# Altium schematic sheet Sheet2.SchDoc
size A; SheetNumber: 2; SheetTotal: 2
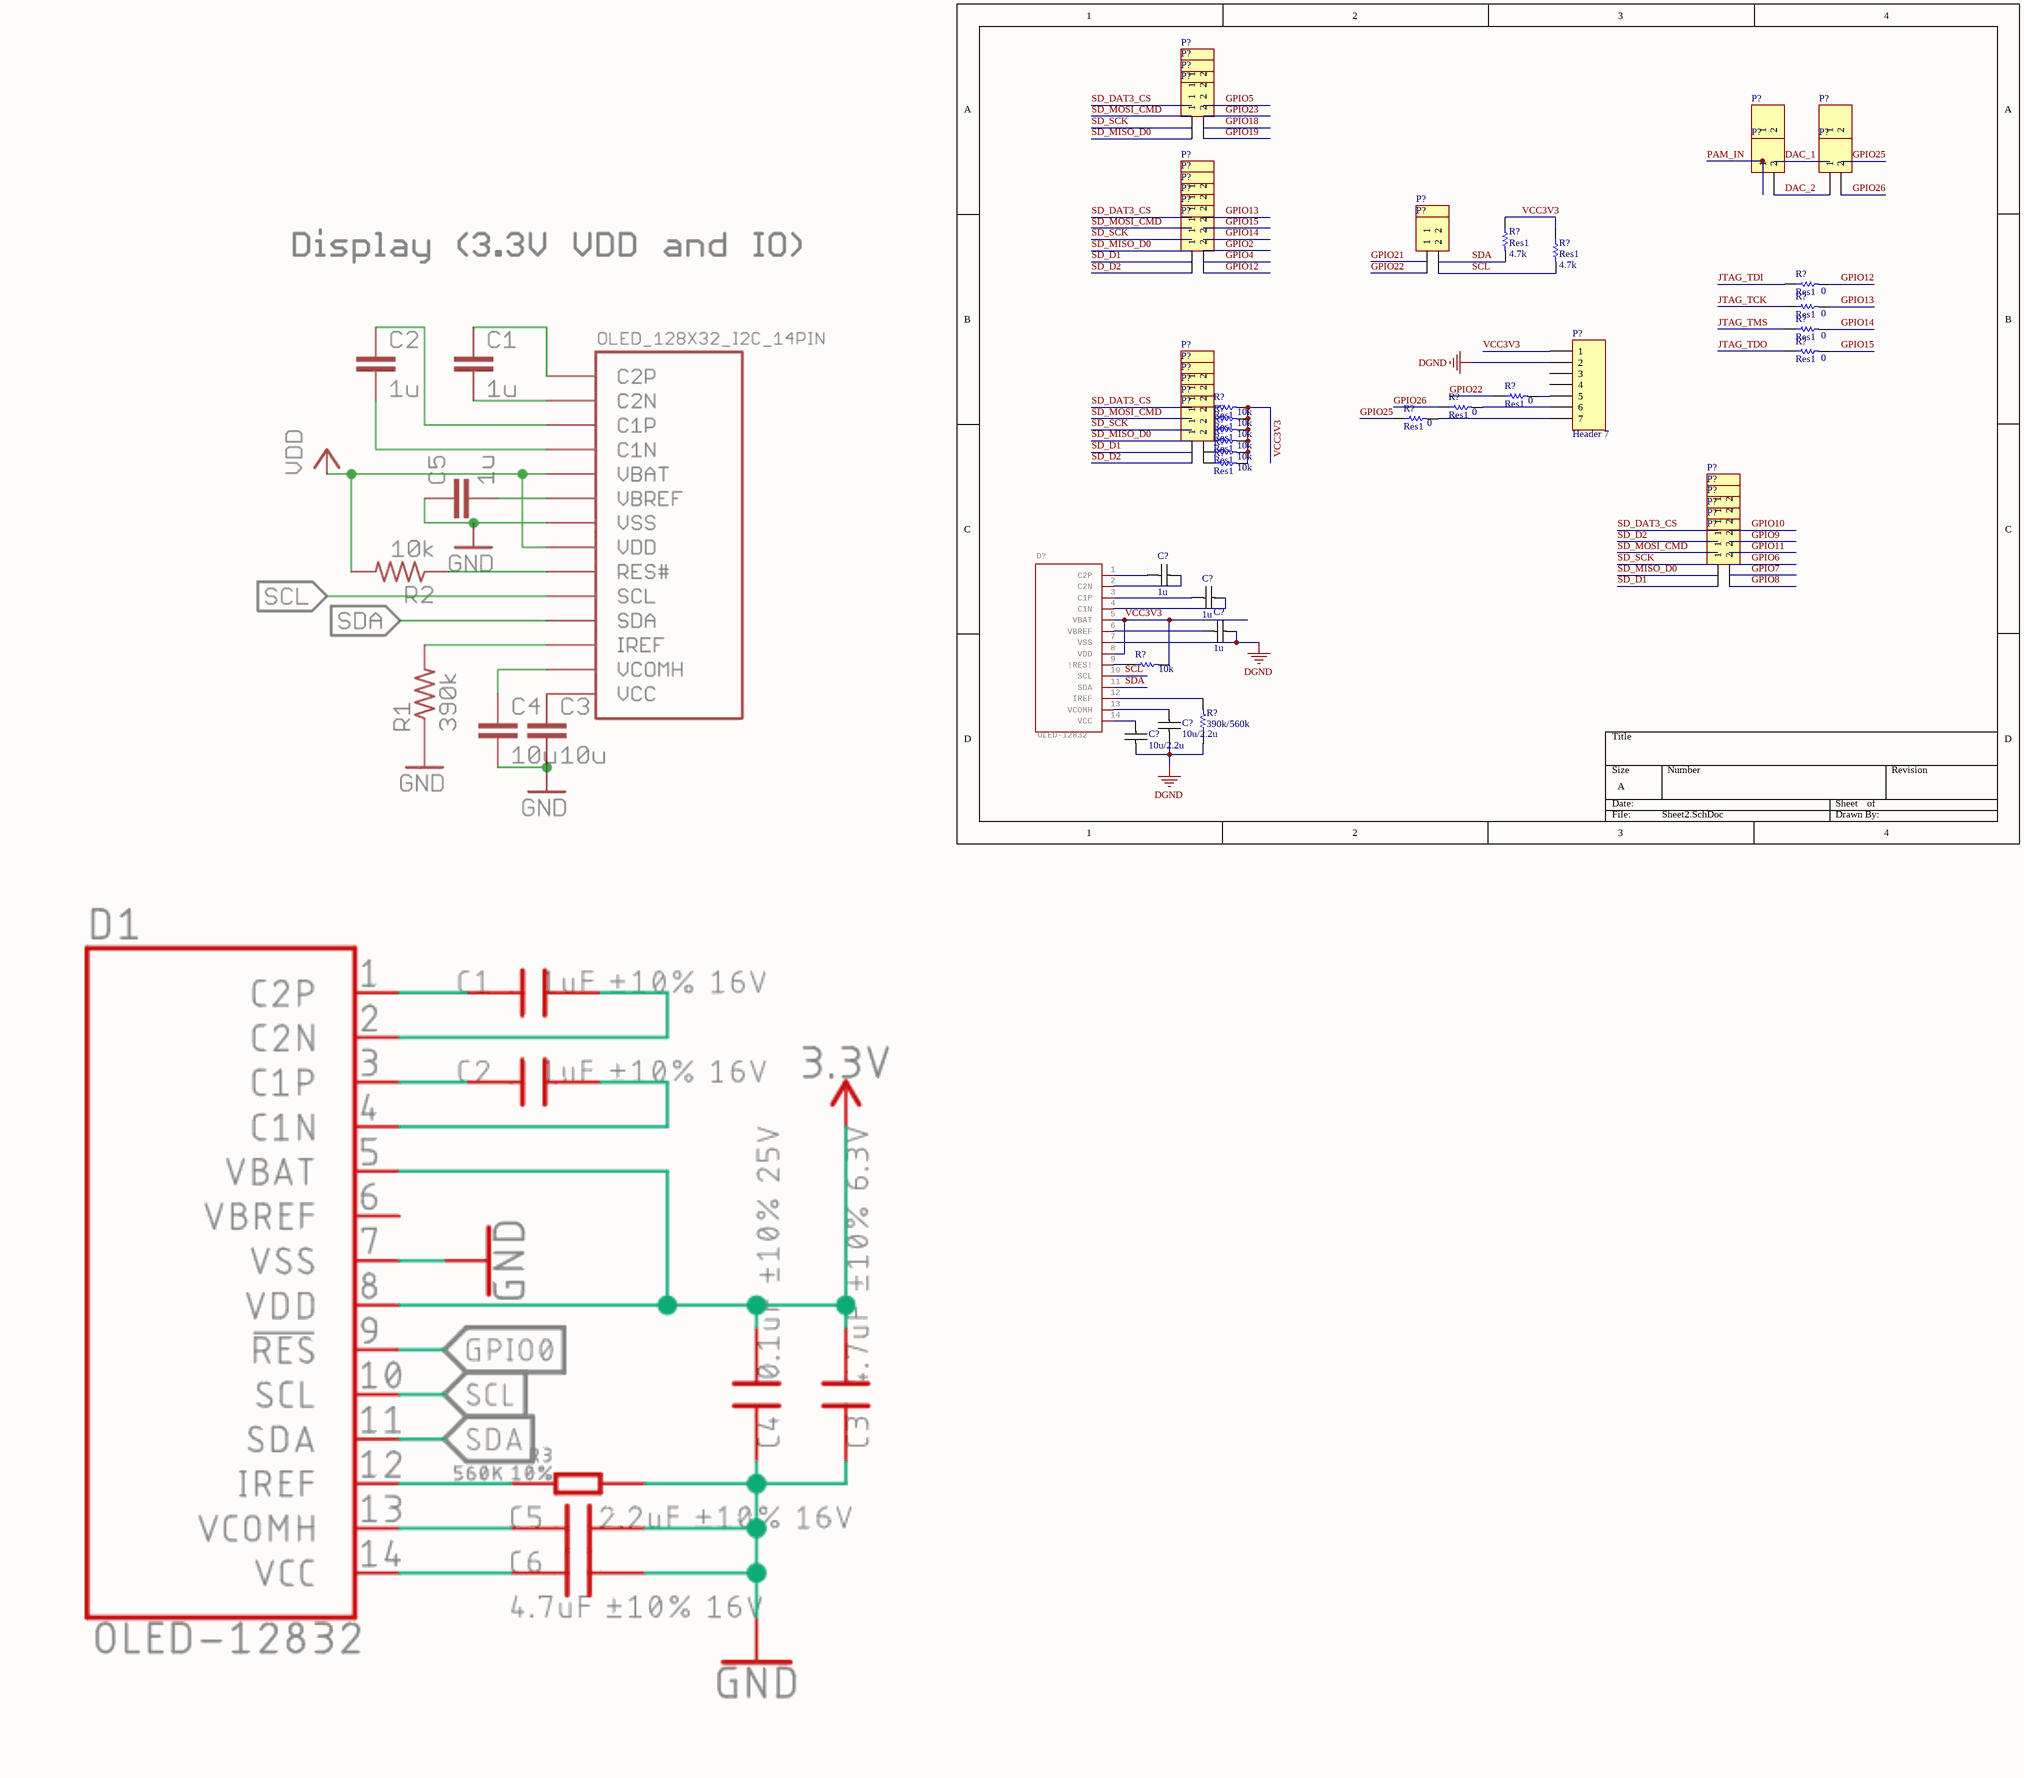
[diagram p0: Sheet2.SchDoc]

## Parts
(Parts that share a designator on the sheet are numbered #1, #2 ... from top to bottom, then left to right.)
C?#1  1u  [C 0603 / 1608]
C?#2  1u  [C 0603 / 1608]
C?#3  1u  [C 0603 / 1608]
C?#4  10u/2.2u  [C 0603 / 1608]
C?#5  10u/2.2u  [C 0603 / 1608]
D?  OLED-12832  [OLED-12832]
P?#1  Header 2  [HDR1X2]  (value not drawn)
P?#2  Header 2  [HDR1X2]  (value not drawn)
P?#3  Header 2  [HDR1X2]  (value not drawn)
P?#4  Header 2  [HDR1X2]  (value not drawn)
P?#5  Header 2  [HDR1X2]  (value not drawn)
P?#6  Header 2  [HDR1X2]  (value not drawn)
P?#7  Header 2  [HDR1X2]  (value not drawn)
P?#8  Header 2  [HDR1X2]  (value not drawn)
P?#9  Header 2  [HDR1X2]  (value not drawn)
P?#10  Header 2  [HDR1X2]  (value not drawn)
P?#11  Header 2  [HDR1X2]  (value not drawn)
P?#12  Header 2  [HDR1X2]  (value not drawn)
P?#13  Header 2  [HDR1X2]  (value not drawn)
P?#14  Header 2  [HDR1X2]  (value not drawn)
P?#15  Header 2  [HDR1X2]  (value not drawn)
P?#16  Header 2  [HDR1X2]  (value not drawn)
P?#17  Header 7  [HDR1X7]
P?#18  Header 2  [HDR1X2]  (value not drawn)
P?#19  Header 2  [HDR1X2]  (value not drawn)
P?#20  Header 2  [HDR1X2]  (value not drawn)
P?#21  Header 2  [HDR1X2]  (value not drawn)
P?#22  Header 2  [HDR1X2]  (value not drawn)
P?#23  Header 2  [HDR1X2]  (value not drawn)
P?#24  Header 2  [HDR1X2]  (value not drawn)
P?#25  Header 2  [HDR1X2]  (value not drawn)
P?#26  Header 2  [HDR1X2]  (value not drawn)
P?#27  Header 2  [HDR1X2]  (value not drawn)
P?#28  Header 2  [HDR1X2]  (value not drawn)
P?#29  Header 2  [HDR1X2]  (value not drawn)
R?#1  Res1  value 4.7k  [C 0603 / 1608]
R?#2  Res1  value 4.7k  [C 0603 / 1608]
R?#3  Res1  value 0  [C 0603 / 1608]
R?#4  Res1  value 0  [C 0603 / 1608]
R?#5  Res1  value 0  [C 0603 / 1608]
R?#6  Res1  value 0  [C 0603 / 1608]
R?#7  Res1  value 0  [C 0603 / 1608]
R?#8  Res1  value 10k  [C 0603 / 1608]
R?#9  Res1  value 0  [C 0603 / 1608]
R?#10  Res1  value 10k  [C 0603 / 1608]
R?#11  Res1  value 0  [C 0603 / 1608]
R?#12  Res1  value 10k  [C 0603 / 1608]
R?#13  Res1  value 10k  [C 0603 / 1608]
R?#14  Res1  value 10k  [C 0603 / 1608]
R?#15  Res1  value 10k  [C 0603 / 1608]
R?#16  value 10k  [C 0603 / 1608]  (hidden comment: Res1)
R?#17  value 390k/560k  [C 0603 / 1608]  (hidden comment: Res1)

## Nets
DGND: C?#3.2 C?#4.1 C?#5.1 D?.7(VSS) P?#17.2 R?#17.1
DAC_1: P?#5.2 P?#6.1
DAC_2: P?#7.2 P?#8.1
GPIO2: P?#12.2
GPIO4: P?#13.2
GPIO5: P?#1.2
GPIO6: P?#27.2
GPIO7: P?#28.2
GPIO8: P?#29.2
GPIO9: P?#25.2
GPIO10: P?#24.2
GPIO11: P?#26.2
GPIO12: P?#15.2 R?#3.2
GPIO13: P?#9.2 R?#4.2
GPIO14: P?#11.2 R?#5.2
GPIO15: P?#10.2 R?#6.2
GPIO18: P?#3.2
GPIO19: P?#4.2
GPIO21: P?#14.1
GPIO22: P?#16.1 R?#7.1
GPIO23: P?#2.2
GPIO25: P?#6.2 R?#11.1
GPIO26: P?#8.2 R?#9.1
JTAG_TCK: R?#4.1
JTAG_TDI: R?#3.1
JTAG_TDO: R?#6.1
JTAG_TMS: R?#5.1
PAM_IN: P?#5.1 P?#7.1
SCL: D?.10(SCL) P?#16.2 R?#2.2
SD_D1: P?#13.1 P?#22.1 P?#29.1
SD_D2: P?#15.1 P?#23.1 P?#25.1
SD_DAT3_CS: P?#1.1 P?#9.1 P?#18.1 P?#24.1
SD_MISO_D0: P?#4.1 P?#12.1 P?#21.1 P?#28.1
SD_MOSI_CMD: P?#2.1 P?#10.1 P?#19.1 P?#26.1
SD_SCK: P?#3.1 P?#11.1 P?#20.1 P?#27.1
SDA: D?.11(SDA) P?#14.2 R?#1.2
VCC3V3: D?.5(VBAT) D?.8(VDD) P?#17.1 R?#1.1 R?#2.1 R?#8.2 R?#10.2 R?#12.2 R?#13.2 R?#14.2 R?#15.2 R?#16.2
NetC?#1_1: C?#1.1 D?.1(C2P)
NetC?#1_2: C?#1.2 D?.2(C2N)
NetC?#2_1: C?#2.1 D?.3(C1P)
NetC?#2_2: C?#2.2 D?.4(C1N)
NetC?#3_1: C?#3.1 D?.6(VBREF)
NetC?#4_2: C?#4.2 D?.13(VCOMH)
NetC?#5_2: C?#5.2 D?.14(VCC)
NetD?_9: D?.9(!RES!) R?#16.1
NetD?_12: D?.12(IREF) R?#17.2
NetP?#17_5: P?#17.5 R?#7.2
NetP?#17_6: P?#17.6 R?#9.2
NetP?#17_7: P?#17.7 R?#11.2
NetP?#18_2: P?#18.2 R?#8.1
NetP?#19_2: P?#19.2 R?#10.1
NetP?#20_2: P?#20.2 R?#12.1
NetP?#21_2: P?#21.2 R?#13.1
NetP?#22_2: P?#22.2 R?#14.1
NetP?#23_2: P?#23.2 R?#15.1

Not connected (* = marked no-connect by the designer): P?#17 3 4

## Library data of the parts
C?#1-C?#5 = Capacitor
D? = OLED-12832: GateName_1: D1; SymbolName_1: OLED-12832; LibraryName: CustomParts; DeviceSetName: OLED-12832; Package: OLED-12832
P?#1-P?#16 P?#18-P?#29 = Header 2: Header, 2-Pin; LatestRevisionDate: 17-Jul-2002; LatestRevisionNote: Re-released for DXP Platform.; Publisher: Altium Limited
P?#17 = Header 7: Header, 7-Pin; LatestRevisionDate: 17-Jul-2002; LatestRevisionNote: Re-released for DXP Platform.; Publisher: Altium Limited
R?#1-R?#17 = Res1: Resistor; Published: 8-Jun-2000; LatestRevisionDate: 17-Jul-2002; LatestRevisionNote: Re-released for DXP Platform.; PackageReference: AXIAL-0.3; Publisher: Altium Limited; PackageDescription: Axial Device, Thru-Hole; 2 Leads; 0.3 in Pin Spacing